# Altium project led_pwr.PrjPcb
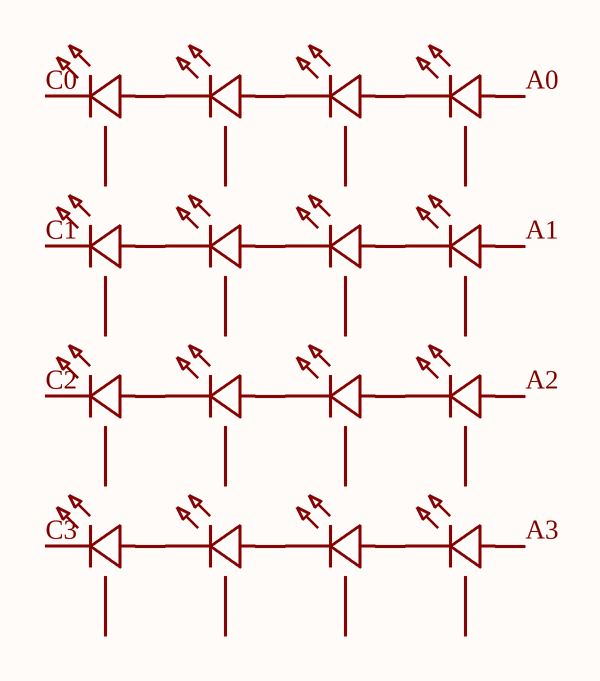
[diagram p0: main.SchDoc]
1 sheet, 16 parts. Net scope: global (net labels, ports and power ports of the same name join across sheets).
Board file: board.PcbDoc

## Sheet main.SchDoc: Main
size A4; Revision: 1; SheetNumber: 1; SheetTotal: 2

### Parts
U1  XL-C3570P8S11-62C3C2  [LED-SMD_3P-L7.0-W3.5_XL-C3570P5S10-62C3C2]  (value not drawn)
U2  XL-C3570P8S11-62C3C2  [LED-SMD_3P-L7.0-W3.5_XL-C3570P5S10-62C3C2]  (value not drawn)
U3  XL-C3570P8S11-62C3C2  [LED-SMD_3P-L7.0-W3.5_XL-C3570P5S10-62C3C2]  (value not drawn)
U4  XL-C3570P8S11-62C3C2  [LED-SMD_3P-L7.0-W3.5_XL-C3570P5S10-62C3C2]  (value not drawn)
U5  XL-C3570P8S11-62C3C2  [LED-SMD_3P-L7.0-W3.5_XL-C3570P5S10-62C3C2]  (value not drawn)
U6  XL-C3570P8S11-62C3C2  [LED-SMD_3P-L7.0-W3.5_XL-C3570P5S10-62C3C2]  (value not drawn)
U7  XL-C3570P8S11-62C3C2  [LED-SMD_3P-L7.0-W3.5_XL-C3570P5S10-62C3C2]  (value not drawn)
U8  XL-C3570P8S11-62C3C2  [LED-SMD_3P-L7.0-W3.5_XL-C3570P5S10-62C3C2]  (value not drawn)
U9  XL-C3570P8S11-62C3C2  [LED-SMD_3P-L7.0-W3.5_XL-C3570P5S10-62C3C2]  (value not drawn)
U10  XL-C3570P8S11-62C3C2  [LED-SMD_3P-L7.0-W3.5_XL-C3570P5S10-62C3C2]  (value not drawn)
U11  XL-C3570P8S11-62C3C2  [LED-SMD_3P-L7.0-W3.5_XL-C3570P5S10-62C3C2]  (value not drawn)
U12  XL-C3570P8S11-62C3C2  [LED-SMD_3P-L7.0-W3.5_XL-C3570P5S10-62C3C2]  (value not drawn)
U13  XL-C3570P8S11-62C3C2  [LED-SMD_3P-L7.0-W3.5_XL-C3570P5S10-62C3C2]  (value not drawn)
U14  XL-C3570P8S11-62C3C2  [LED-SMD_3P-L7.0-W3.5_XL-C3570P5S10-62C3C2]  (value not drawn)
U15  XL-C3570P8S11-62C3C2  [LED-SMD_3P-L7.0-W3.5_XL-C3570P5S10-62C3C2]  (value not drawn)
U16  XL-C3570P8S11-62C3C2  [LED-SMD_3P-L7.0-W3.5_XL-C3570P5S10-62C3C2]  (value not drawn)

### Nets
A0: U4.3(A)
A1: U8.3(A)
A2: U12.3(A)
A3: U16.3(A)
C0: U1.1(K)
C1: U5.1(K)
C2: U9.1(K)
C3: U13.1(K)
NetU1_3: U1.3(A) U2.1(K)
NetU2_3: U2.3(A) U3.1(K)
NetU3_3: U3.3(A) U4.1(K)
NetU5_3: U5.3(A) U6.1(K)
NetU6_3: U6.3(A) U7.1(K)
NetU7_3: U7.3(A) U8.1(K)
NetU9_3: U9.3(A) U10.1(K)
NetU10_3: U10.3(A) U11.1(K)
NetU11_3: U11.3(A) U12.1(K)
NetU13_3: U13.3(A) U14.1(K)
NetU14_3: U14.3(A) U15.1(K)
NetU15_3: U15.3(A) U16.1(K)

Not connected (* = marked no-connect by the designer): U1 2(D); U2 2(D); U3 2(D); U4 2(D); U5 2(D); U6 2(D); U7 2(D); U8 2(D); U9 2(D); U10 2(D); U11 2(D); U12 2(D); U13 2(D); U14 2(D); U15 2(D); U16 2(D)

### Library data of the parts
U1-U16 = XL-C3570P8S11-62C3C2: BOM_Manufacturer: XINGLIGHT(成兴光); Contributor: lcsc; BOM_Supplier: LCSC; BOM_Supplier Part: C3646958; BOM_Manufacturer Part: XL-C3570P8S11-62C3C2; link: https://atta.szlcsc.com/upload/public/pdf/source/20220704/B3096392B255514FF7F2408DB5835905.pdf; BOM_JLCPCB Part Class: Extended Part; spicePre: U; spiceSymbolName: XL-C3570P8S11-62C3C2